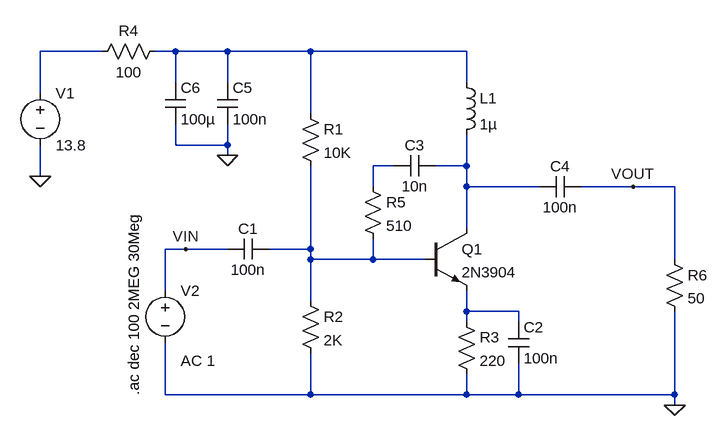
[diagram p0: schematic ZL2CTM_RF_AMP.asc]
ZL2CTM_RF_AMP.asc, the LTspice schematic file:
Version 4
SHEET 1 880 680
WIRE -272 -144 -368 -144
WIRE -160 -144 -192 -144
WIRE -80 -144 -160 -144
WIRE 48 -144 -80 -144
WIRE 288 -144 48 -144
WIRE -160 -96 -160 -144
WIRE -80 -96 -80 -144
WIRE 288 -96 288 -144
WIRE -368 -80 -368 -144
WIRE 48 -48 48 -144
WIRE -160 0 -160 -32
WIRE -80 0 -80 -32
WIRE -80 0 -160 0
WIRE -80 16 -80 0
WIRE 176 32 144 32
WIRE 288 32 288 -16
WIRE 288 32 240 32
WIRE -368 48 -368 0
WIRE 144 64 144 32
WIRE 288 64 288 32
WIRE 400 64 288 64
WIRE 544 64 464 64
WIRE 608 64 544 64
WIRE 288 128 288 64
WIRE -144 160 -176 160
WIRE -80 160 -144 160
WIRE 48 160 48 32
WIRE 48 160 -16 160
WIRE 48 176 48 160
WIRE 144 176 144 144
WIRE 144 176 48 176
WIRE 224 176 144 176
WIRE 608 176 608 64
WIRE -176 224 -176 160
WIRE 48 240 48 176
WIRE 288 256 288 224
WIRE 368 256 288 256
WIRE 288 272 288 256
WIRE 368 272 368 256
WIRE -176 384 -176 304
WIRE 48 384 48 320
WIRE 48 384 -176 384
WIRE 288 384 288 352
WIRE 288 384 48 384
WIRE 368 384 368 336
WIRE 368 384 288 384
WIRE 608 384 608 256
WIRE 608 384 368 384
WIRE 608 400 608 384
FLAG -368 48 0
FLAG 608 400 0
FLAG -144 160 VIN
FLAG 544 64 VOUT
FLAG -80 16 0
SYMBOL res 32 -64 R0
SYMATTR InstName R1
SYMATTR Value 10K
SYMBOL res 32 224 R0
SYMATTR InstName R2
SYMATTR Value 2K
SYMBOL cap -16 144 R90
WINDOW 0 0 32 VBottom 2
WINDOW 3 32 32 VTop 2
SYMATTR InstName C1
SYMATTR Value 100n
SYMBOL npn 224 128 R0
SYMATTR InstName Q1
SYMATTR Value 2N3904
SYMBOL ind 272 -112 R0
SYMATTR InstName L1
SYMATTR Value 1µ
SYMBOL res 272 256 R0
SYMATTR InstName R3
SYMATTR Value 220
SYMBOL cap 352 272 R0
SYMATTR InstName C2
SYMATTR Value 100n
SYMBOL res -176 -160 R90
WINDOW 0 0 56 VBottom 2
WINDOW 3 32 56 VTop 2
SYMATTR InstName R4
SYMATTR Value 100
SYMBOL res 128 48 R0
SYMATTR InstName R5
SYMATTR Value 510
SYMBOL cap 240 16 R90
WINDOW 0 0 32 VBottom 2
WINDOW 3 32 32 VTop 2
SYMATTR InstName C3
SYMATTR Value 10n
SYMBOL cap 464 48 R90
WINDOW 0 0 32 VBottom 2
WINDOW 3 32 32 VTop 2
SYMATTR InstName C4
SYMATTR Value 100n
SYMBOL res 592 160 R0
SYMATTR InstName R6
SYMATTR Value 50
SYMBOL voltage -368 -96 R0
SYMATTR InstName V1
SYMATTR Value 13.8
SYMBOL voltage -176 208 R0
WINDOW 123 24 124 Left 2
WINDOW 39 0 0 Left 0
SYMATTR Value2 AC 1
SYMATTR InstName V2
SYMATTR Value ""
SYMBOL cap -96 -96 R0
SYMATTR InstName C5
SYMATTR Value 100n
SYMBOL cap -176 -96 R0
SYMATTR InstName C6
SYMATTR Value 100µ
TEXT -224 104 VRight 2 !.ac dec 100 2MEG 30Meg

The netlist it stands for:
* ZL2CTM_RF_AMP.asc
R1 N002 N005 10K
R2 N005 0 2K
C1 N005 VIN 100n
Q1 N004 N005 N006 0 2N3904
L1 N002 N004 1µ
R3 N006 0 220
C2 N006 0 100n
R4 N002 N001 100
R5 N003 N005 510
C3 N004 N003 10n
C4 VOUT N004 100n
R6 VOUT 0 50
V1 N001 0 13.8
V2 VIN 0 AC 1
C5 N002 0 100n
C6 N002 0 100µ
.model NPN NPN
.model PNP PNP
.lib standard.bjt
.ac dec 100 2MEG 30Meg
.backanno
.end